# EasyEDA Pro project SCH.epro

# Schematic cardreader
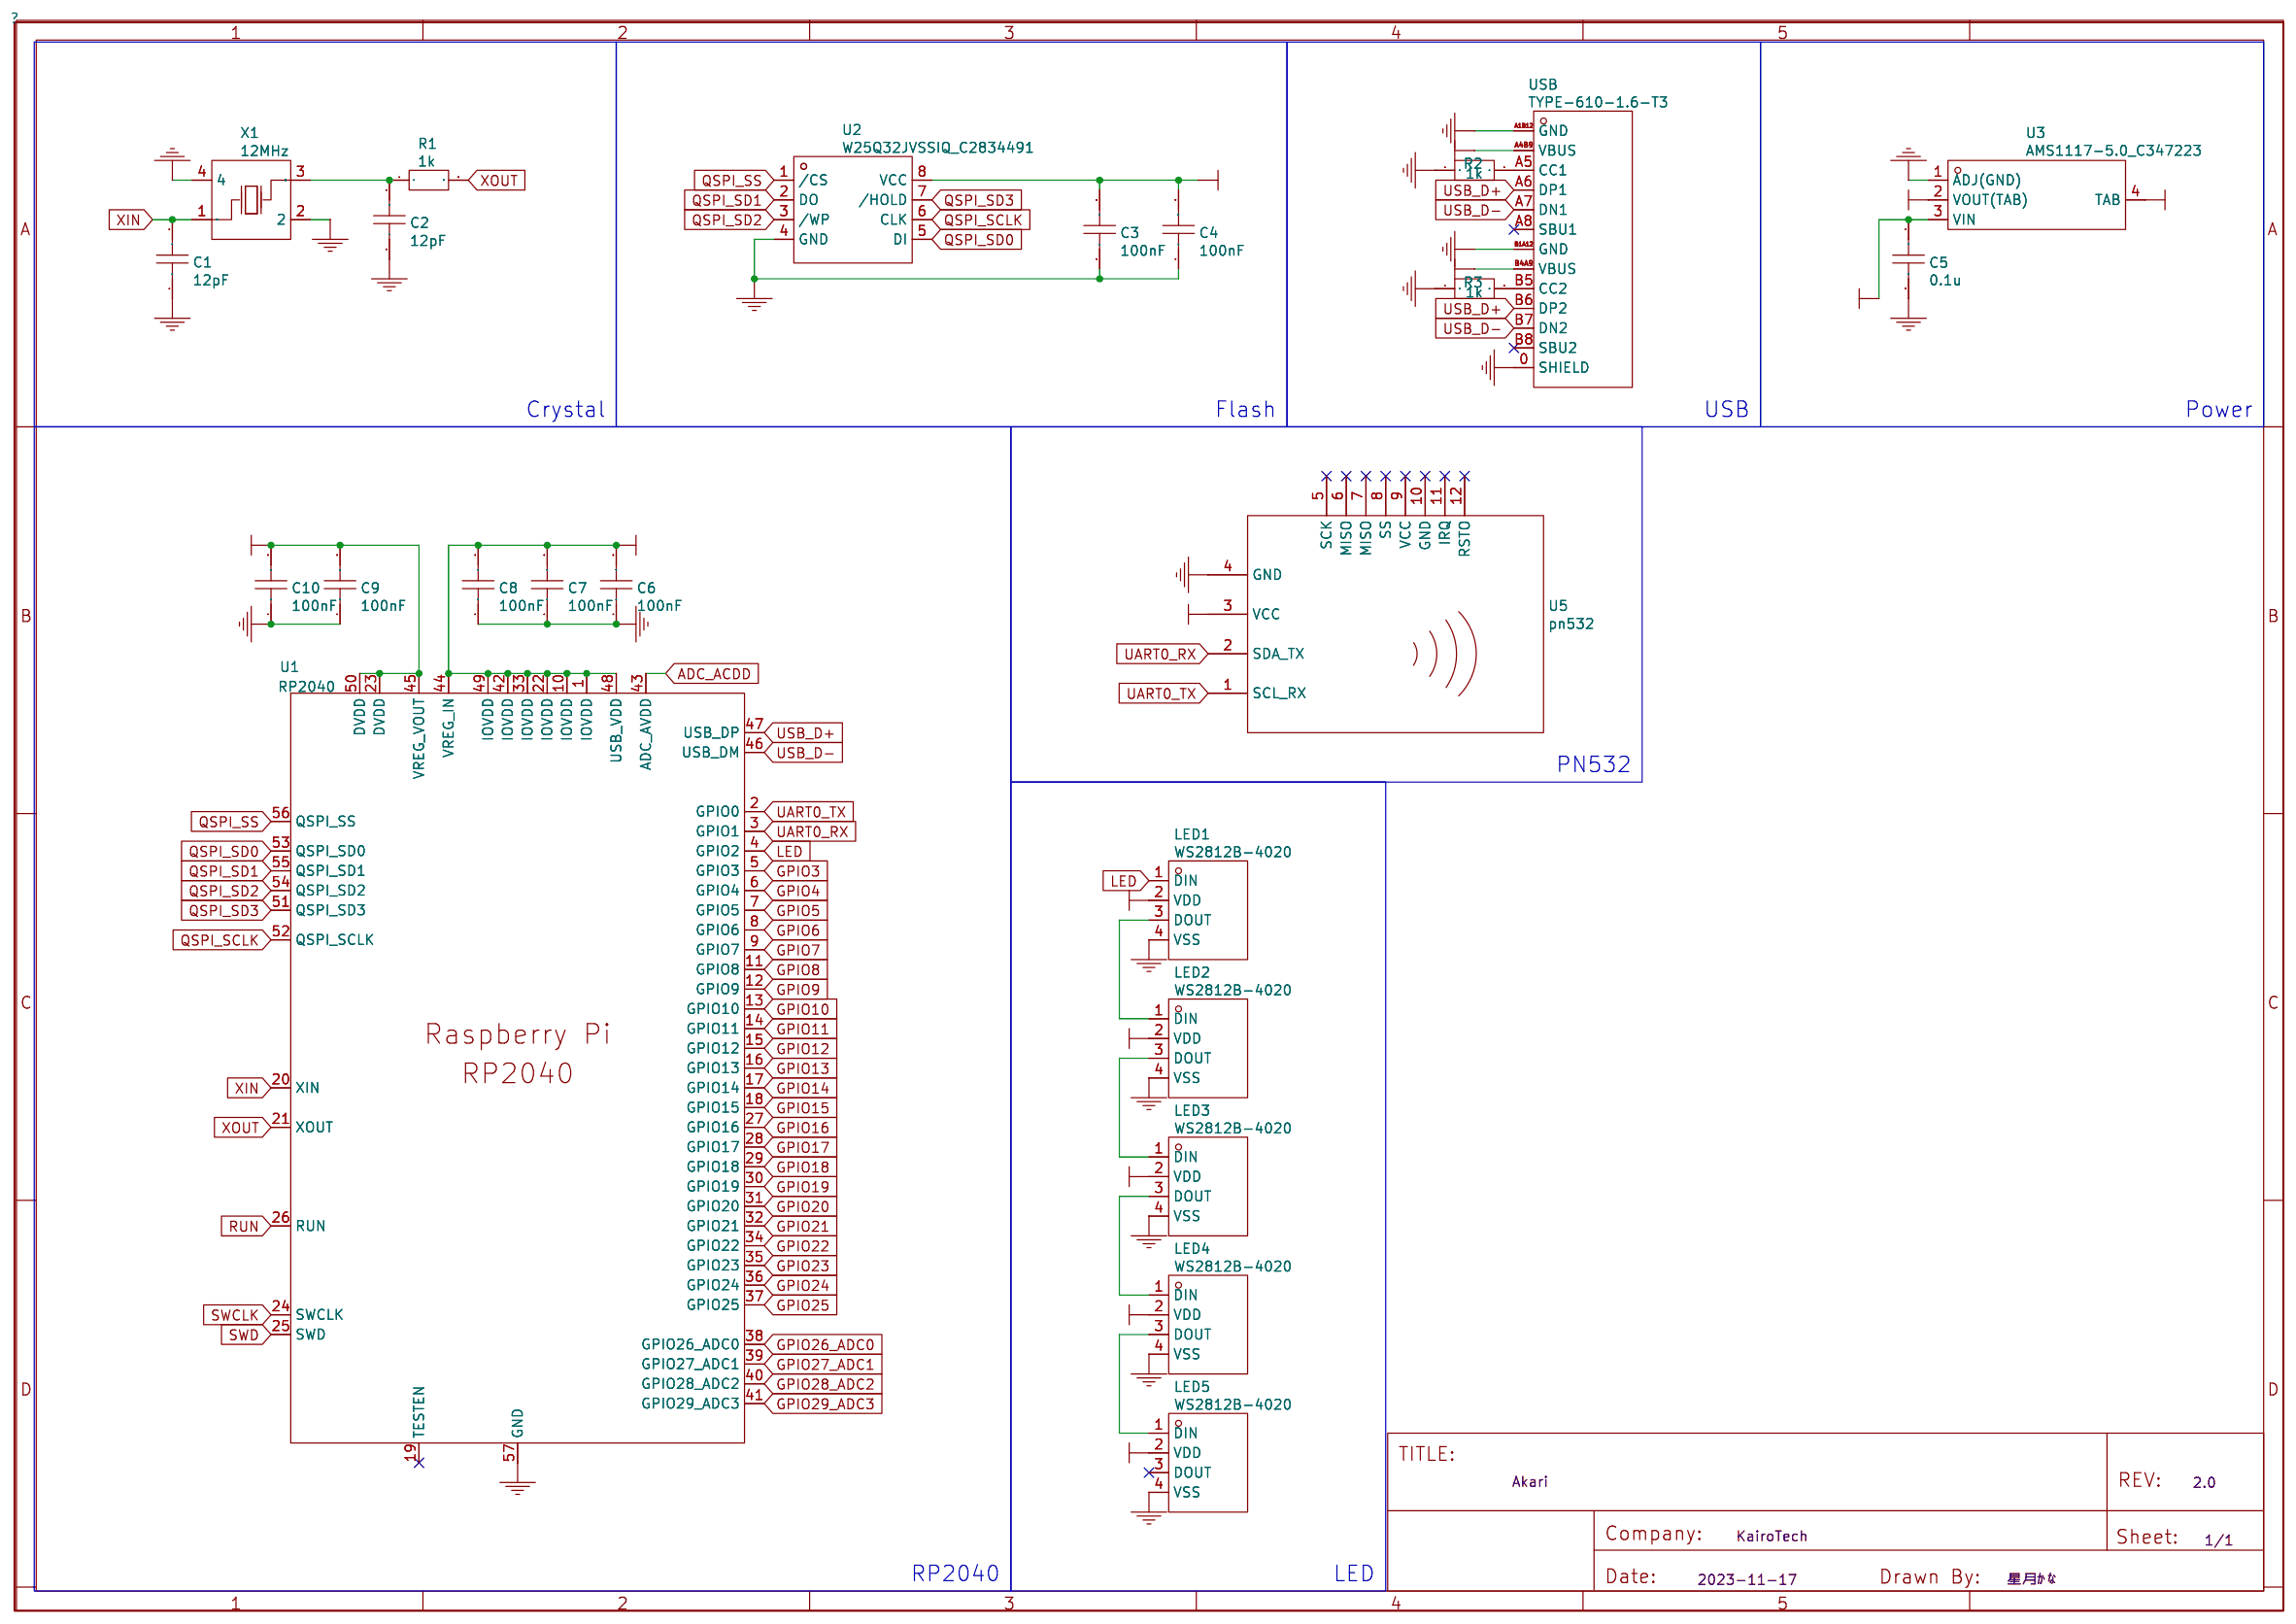
[diagram p0: schematic sheet]

## Parts
C1  12pF  [C0603]
C2  12pF  [C0603]
C3  100nF  [C0603]
C4  100nF  [C0603]
C5  0.1u  [C0603]
C6  100nF  [C0603]
C7  100nF  [C0603]
C8  100nF  [C0603]
C9  100nF  [C0603]
C10  100nF  [C0603]
LED1  WS2812B-4020  [LED-SMD_WS2812B-4020]
LED2  WS2812B-4020  [LED-SMD_WS2812B-4020]
LED3  WS2812B-4020  [LED-SMD_WS2812B-4020]
LED4  WS2812B-4020  [LED-SMD_WS2812B-4020]
LED5  WS2812B-4020  [LED-SMD_WS2812B-4020]
R1  1k  [R0603]
R2  1k  [R0603]
R3  1k  [R0603]
U1  RP2040  [LQFN-56_L7.0-W7.0-P0.4-EP]
U2  W25Q32JVSSIQ_C2834491  [SOIC-8_L5.2-W5.2-P1.27-LS7.9-BL]
U3  AMS1117-5.0_C347223  [SOT-223_L6.7-W3.5-P2.30-BR]
U5  pn532  [PN532]
USB  TYPE-610-1.6-T3  [USB-C-SMD_TYPE-C-16P-610-1.6-T3]
X1  12MHz  [CRYSTAL-SMD_4P-L2.5-W2.0-BL_XTAL12MHZ]

## Library data of the parts
C1 C2 = 12pF
C3 C4 C6-C10 = 100nF
C5 = 0.1u
LED1-LED5 = WS2812B-4020: Supplier: LCSC; Supplier Part: C965557; Manufacturer: worldsemi; JLCPCB Part Class: Extended Part; link: https://so.szlcsc.com/global.html?k=C965557&amp;ref=editor
R1-R3 = 1k
U1 = RP2040: Supplier: LCSC; Supplier Part: C2040; Manufacturer: Raspberry Pi(树莓派); JLCPCB Part Class: Extended Part; link: https://so.szlcsc.com/global.html?k=C2040&amp;ref=editor
U2 = W25Q32JVSSIQ_C2834491: Supplier: LCSC; Supplier Part: C2834491; Manufacturer: WINBOND(华邦); Manufacturer Part: W25Q32JVSSIQ; JLCPCB Part Class: Extended Part; link: https://so.szlcsc.com/global.html?k=C2834491&amp;ref=editor
U3 = AMS1117-5.0_C347223: Supplier: LCSC; Supplier Part: C347223; Manufacturer: UMW(广东友台半导体); Manufacturer Part: AMS1117-5.0; JLCPCB Part Class: Extended Part; link: https://so.szlcsc.com/global.html?k=C347223&amp;ref=editor
U5 = pn532
USB = TYPE-610-1.6-T3: Supplier: LCSC; Supplier Part: C2972115; Manufacturer: Yuandi(元迪); JLCPCB Part Class: Extended Part; link: https://so.szlcsc.com/global.html?k=C2972115&amp;ref=editor
X1 = 12MHz: Supplier: LCSC; Supplier Part: C1985574; Manufacturer: ABRACON; Manufacturer Part: ABM10AIG-12.000MHZ-4Z-T3; JLCPCB Part Class: Extended Part; link: https://so.szlcsc.com/global.html?k=C1985574&amp;ref=editor

## Nets
1V1: C9.2 C10.2 U1.23(DVDD) U1.45(VREG_VOUT) U1.50(DVDD)
3V3: C3.2 C4.2 C6.2 C7.2 C8.2 U1.1(IOVDD) U1.10(IOVDD) U1.22(IOVDD) U1.33(IOVDD) U1.42(IOVDD) U1.44(VREG_IN) U1.48(USB_VDD) U1.49(IOVDD) U2.8(VCC) U3.2(VOUT(TAB)) U3.4(TAB)
GND: C1.1 C2.2 C3.1 C4.1 C5.2 C6.1 C7.1 C8.1 C9.1 C10.1 LED1.4(VSS) LED2.4(VSS) LED3.4(VSS) LED4.4(VSS) LED5.4(VSS) R2.1 R3.1 U1.57(GND) U2.4(GND) U3.1(ADJ(GND)) U5.4(GND) USB.0(SHIELD) USB.A1B12(GND) USB.B1A12(GND) X1.2 X1.4
VCC: C5.1 LED1.2(VDD) LED2.2(VDD) LED3.2(VDD) LED4.2(VDD) LED5.2(VDD) U3.3(VIN) U5.3(VCC) USB.A4B9(VBUS) USB.B4A9(VBUS)
ADC_ACDD: U1.43(ADC_AVDD)
GPIO3: U1.5(GPIO3)
GPIO4: U1.6(GPIO4)
GPIO5: U1.7(GPIO5)
GPIO6: U1.8(GPIO6)
GPIO7: U1.9(GPIO7)
GPIO8: U1.11(GPIO8)
GPIO9: U1.12(GPIO9)
GPIO10: U1.13(GPIO10)
GPIO11: U1.14(GPIO11)
GPIO12: U1.15(GPIO12)
GPIO13: U1.16(GPIO13)
GPIO14: U1.17(GPIO14)
GPIO15: U1.18(GPIO15)
GPIO16: U1.27(GPIO16)
GPIO17: U1.28(GPIO17)
GPIO18: U1.29(GPIO18)
GPIO19: U1.30(GPIO19)
GPIO20: U1.31(GPIO20)
GPIO21: U1.32(GPIO21)
GPIO22: U1.34(GPIO22)
GPIO23: U1.35(GPIO23)
GPIO24: U1.36(GPIO24)
GPIO25: U1.37(GPIO25)
GPIO26_ADC0: U1.38(GPIO26_ADC0)
GPIO27_ADC1: U1.39(GPIO27_ADC1)
GPIO28_ADC2: U1.40(GPIO28_ADC2)
GPIO29_ADC3: U1.41(GPIO29_ADC3)
LED: LED1.1(DIN) U1.4(GPIO2)
QSPI_SCLK: U1.52(QSPI_SCLK) U2.6(CLK)
QSPI_SD0: U1.53(QSPI_SD0) U2.5(DI)
QSPI_SD1: U1.55(QSPI_SD1) U2.2(DO)
QSPI_SD2: U1.54(QSPI_SD2) U2.3(/WP)
QSPI_SD3: U1.51(QSPI_SD3) U2.7(/HOLD)
QSPI_SS: U1.56(QSPI_SS) U2.1(/CS)
RUN: U1.26(RUN)
SWCLK: U1.24(SWCLK)
SWD: U1.25(SWD)
UART0_RX: U1.3(GPIO1) U5.2(SDA_TX)
UART0_TX: U1.2(GPIO0) U5.1(SCL_RX)
USB_D+: U1.47(USB_DP) USB.A6(DP1) USB.B6(DP2)
USB_D-: U1.46(USB_DM) USB.A7(DN1) USB.B7(DN2)
XIN: C1.2 U1.20(XIN) X1.1(OSC1)
XOUT: R1.2 U1.21(XOUT)
Net-(C2-1): C2.1 R1.1 X1.3(OSC2)
Net-(LED1-3): LED1.3(DOUT) LED2.1(DIN)
Net-(LED2-3): LED2.3(DOUT) LED3.1(DIN)
Net-(LED3-3): LED3.3(DOUT) LED4.1(DIN)
Net-(LED4-3): LED4.3(DOUT) LED5.1(DIN)
Net-(R2-2): R2.2 USB.A5(CC1)
Net-(R3-2): R3.2 USB.B5(CC2)

Not connected (* = marked no-connect by the designer): LED5 3(DOUT)*; U1 19(TESTEN)*; U5 5(SCK)* 6(MISO)* 7(MISO)* 8(SS)* 9(VCC)* 10(GND)* 11(IRQ)* 12(RSTO)*; USB A8(SBU1)* B8(SBU2)*

## Notes on the sheet
- Crystal
- Flash
- USB
- Power
- PN532
- RP2040
- LED
